# EAGLE design Placa de processamento (EAGLE 9.6.2)
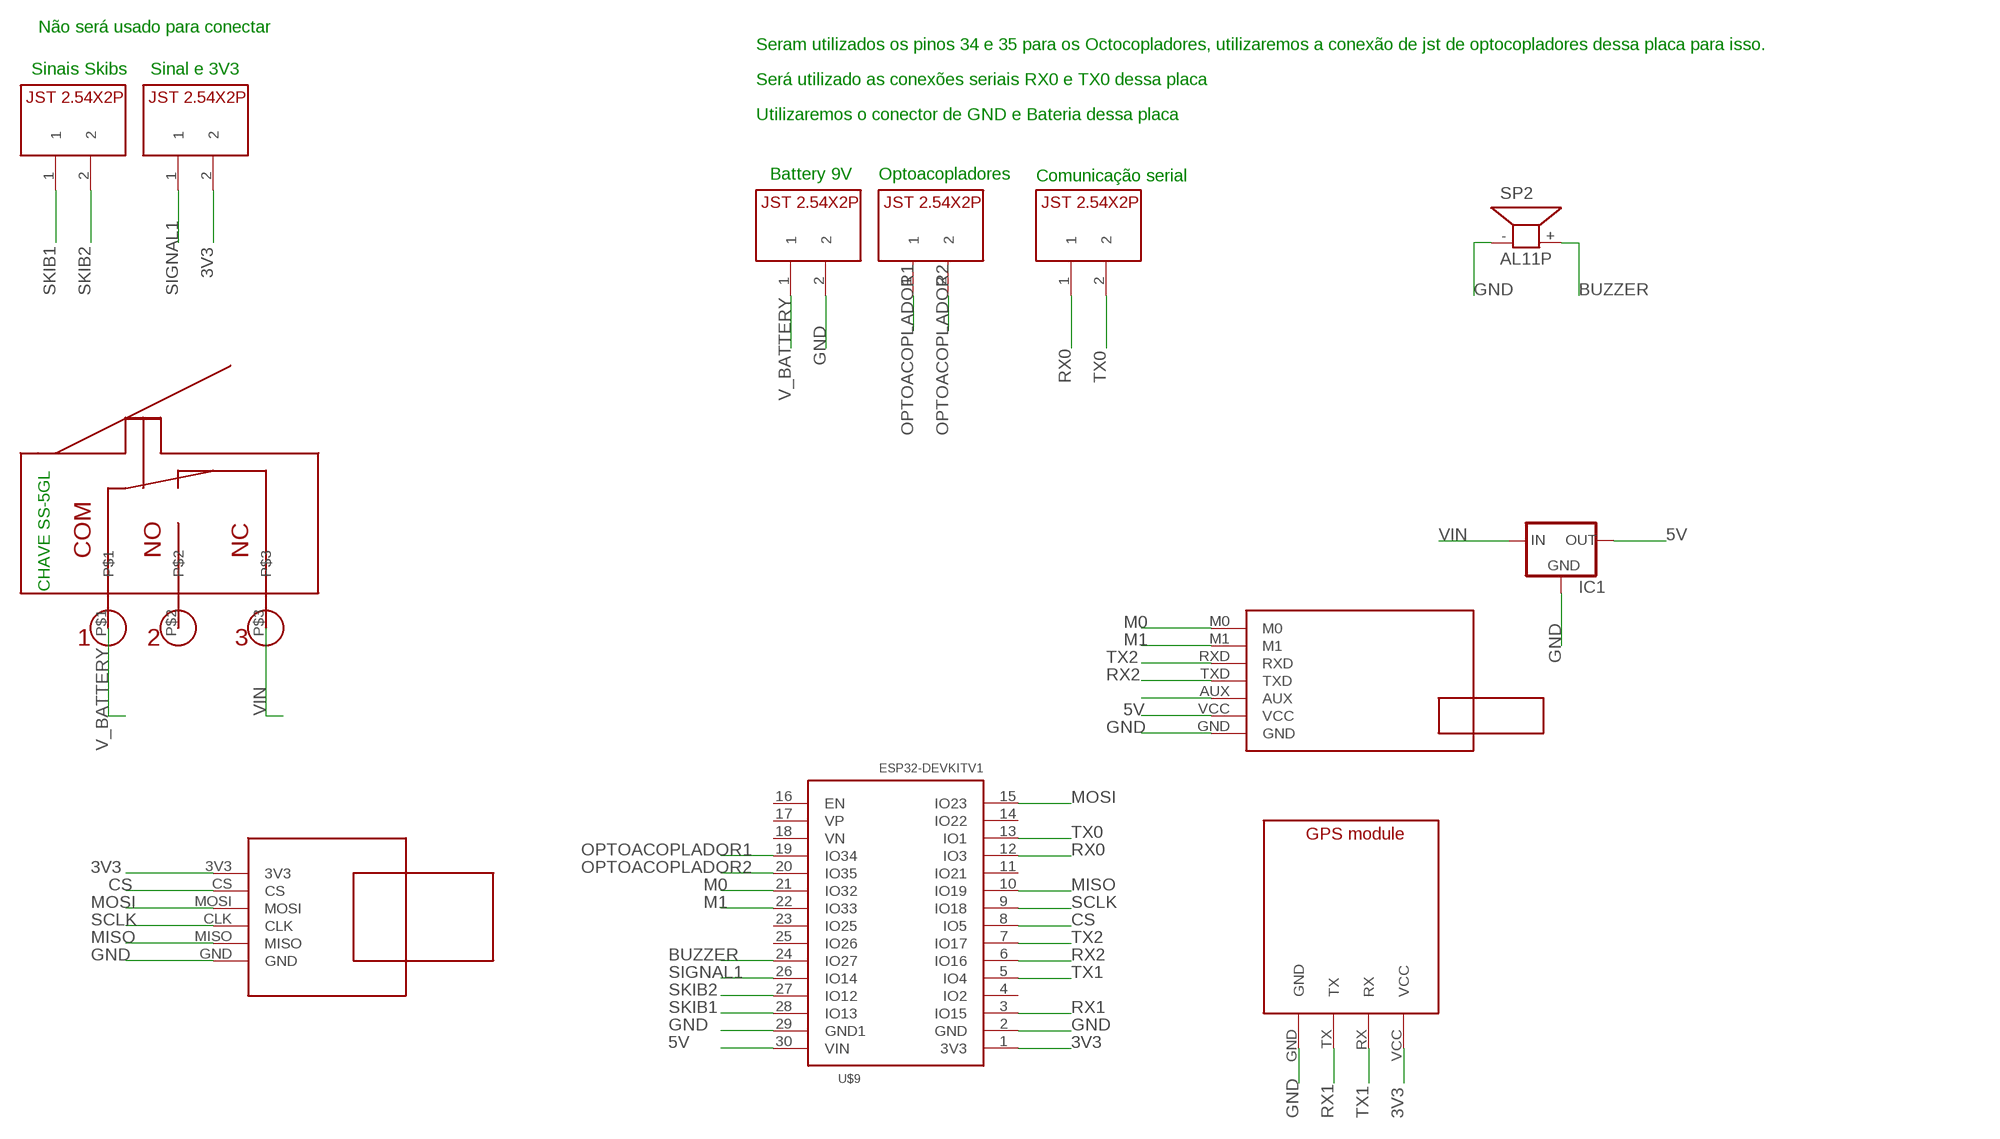
[diagram p0: schematic, sheet 1]

## Parts
IC1  78XXL  [78XXL]
SP2  AL11P  [AL11P]
U$2  MICROSD_SMALL_READER  [MICROSD_SMALL_READER_FOOTPRINT]
U$3  JST2.54X2P  [JST2.54X2P_FOOTPRINT]
U$4  JST2.54X2P  [JST2.54X2P_FOOTPRINT]
U$5  JST2.54X2P  [JST2.54X2P_FOOTPRINT]
U$6  JST2.54X2P  [JST2.54X2P_FOOTPRINT]
U$7  GPS_MODULE  [GPS_MODULE_FOOTPRINT]
U$8  E22-400T30D  [E22-400T30D_FOOTPRINT]
U$9  ESP32DEVKITV1  [ESP32-DEVKITV1]
U$10  JST2.54X2P  [JST2.54X2P_FOOTPRINT]
U$11  CHAVE_SS-5GL  [CHAVESS-5GL]

## Nets
3V3: U$2.3V3 U$5.2 U$7.VCC U$9.1(3V3)
5V: IC1.OUT U$8.VCC U$9.30(VIN)
BUZZER: SP2.+ U$9.24(IO27)
CS: U$2.CS U$9.8(IO5)
GND: IC1.GND SP2.- U$2.GND U$3.2 U$7.GND U$8.GND U$9.2(GND) U$9.29(GND1)
M0: U$8.M0 U$9.21(IO32)
M1: U$8.M1 U$9.22(IO33)
MISO: U$2.MISO U$9.10(IO19)
MOSI: U$2.MOSI U$9.15(IO23)
N$3: U$8.AUX
OPTOACOPLADOR1: U$6.1 U$9.19(IO34)
OPTOACOPLADOR2: U$6.2 U$9.20(IO35)
RX0: U$9.12(IO3) U$10.1
RX1: U$7.TX U$9.3(IO15)
RX2: U$8.TXD U$9.6(IO16)
SCLK: U$2.CLK U$9.9(IO18)
SIGNAL1: U$5.1 U$9.26(IO14)
SKIB1: U$4.1 U$9.28(IO13)
SKIB2: U$4.2 U$9.27(IO12)
TX0: U$9.13(IO1) U$10.2
TX1: U$7.RX U$9.5(IO4)
TX2: U$8.RXD U$9.7(IO17)
V_BATTERY: U$3.1 U$11.P$1
VIN: IC1.IN U$11.P$3
Unconnected: U$9.4(IO2) U$9.11(IO21) U$9.14(IO22) U$9.16(EN) U$9.17(VP) U$9.18(VN) U$9.23(IO25) U$9.25(IO26) U$11.P$2

## Notes on the sheet
- Não será usado para conectar
- Seram utilizados os pinos 34 e 35 para os Octocopladores, utilizaremos a conexão de jst de optocopladores dessa placa para isso.
- Sinais Skibs | Sinal e 3V3
- Será utilizado as conexões seriais RX0 e TX0 dessa placa
- Utilizaremos o conector de GND e Bateria dessa placa
- Battery 9V | Optoacopladores | Comunicação serial

## Library data of the parts
IC1 = v-reg:78XXL: VOLTAGE REGULATOR
SP2 = buzzer:AL11P: SPEAKER Source: Buerklin; OC_FARNELL: unknown; OC_NEWARK: unknown
U$2 = CRD:MICROSD_SMALL_READER
U$3-U$6 U$10 = CRD:JST2.54X2P: Conector JST 2 pinos (2.54mm de distância entre pinos)
U$7 = CRD:GPS_MODULE
U$8 = CRD:E22-400T30D
U$9 = ESP32-DEVKITV1:ESP32DEVKITV1
U$11 = CRD:CHAVE_SS-5GL

## Board
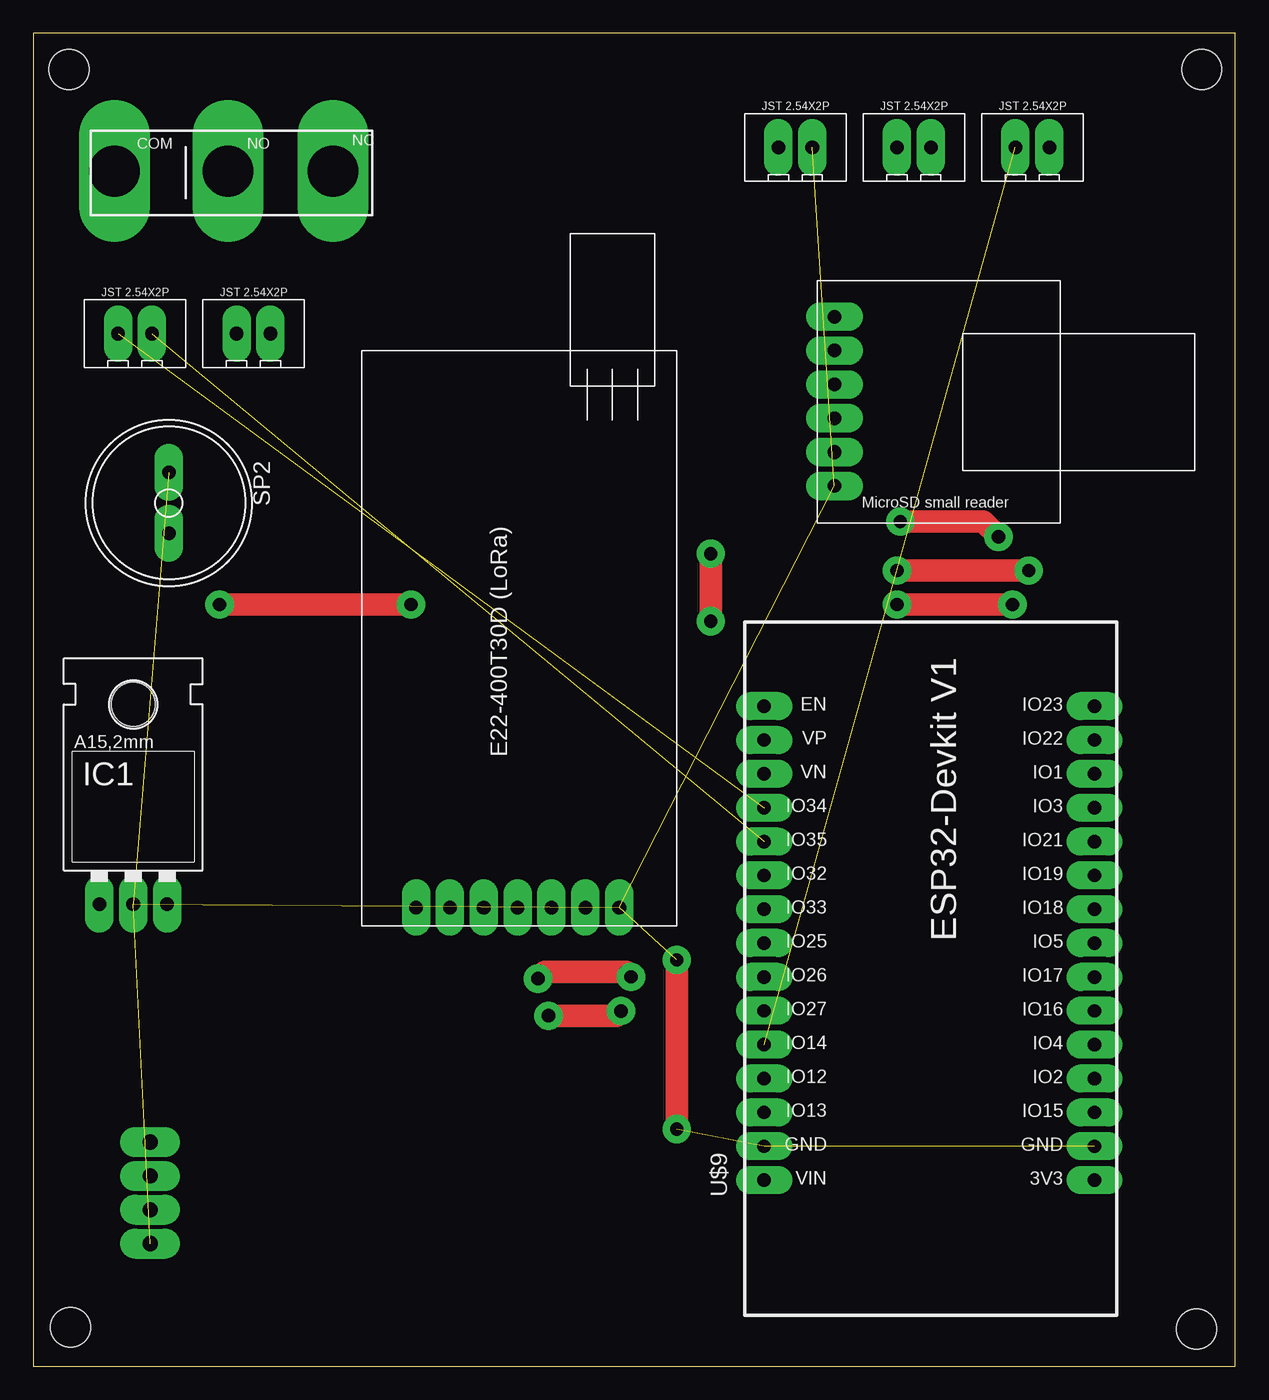
[diagram p1: board, top side]
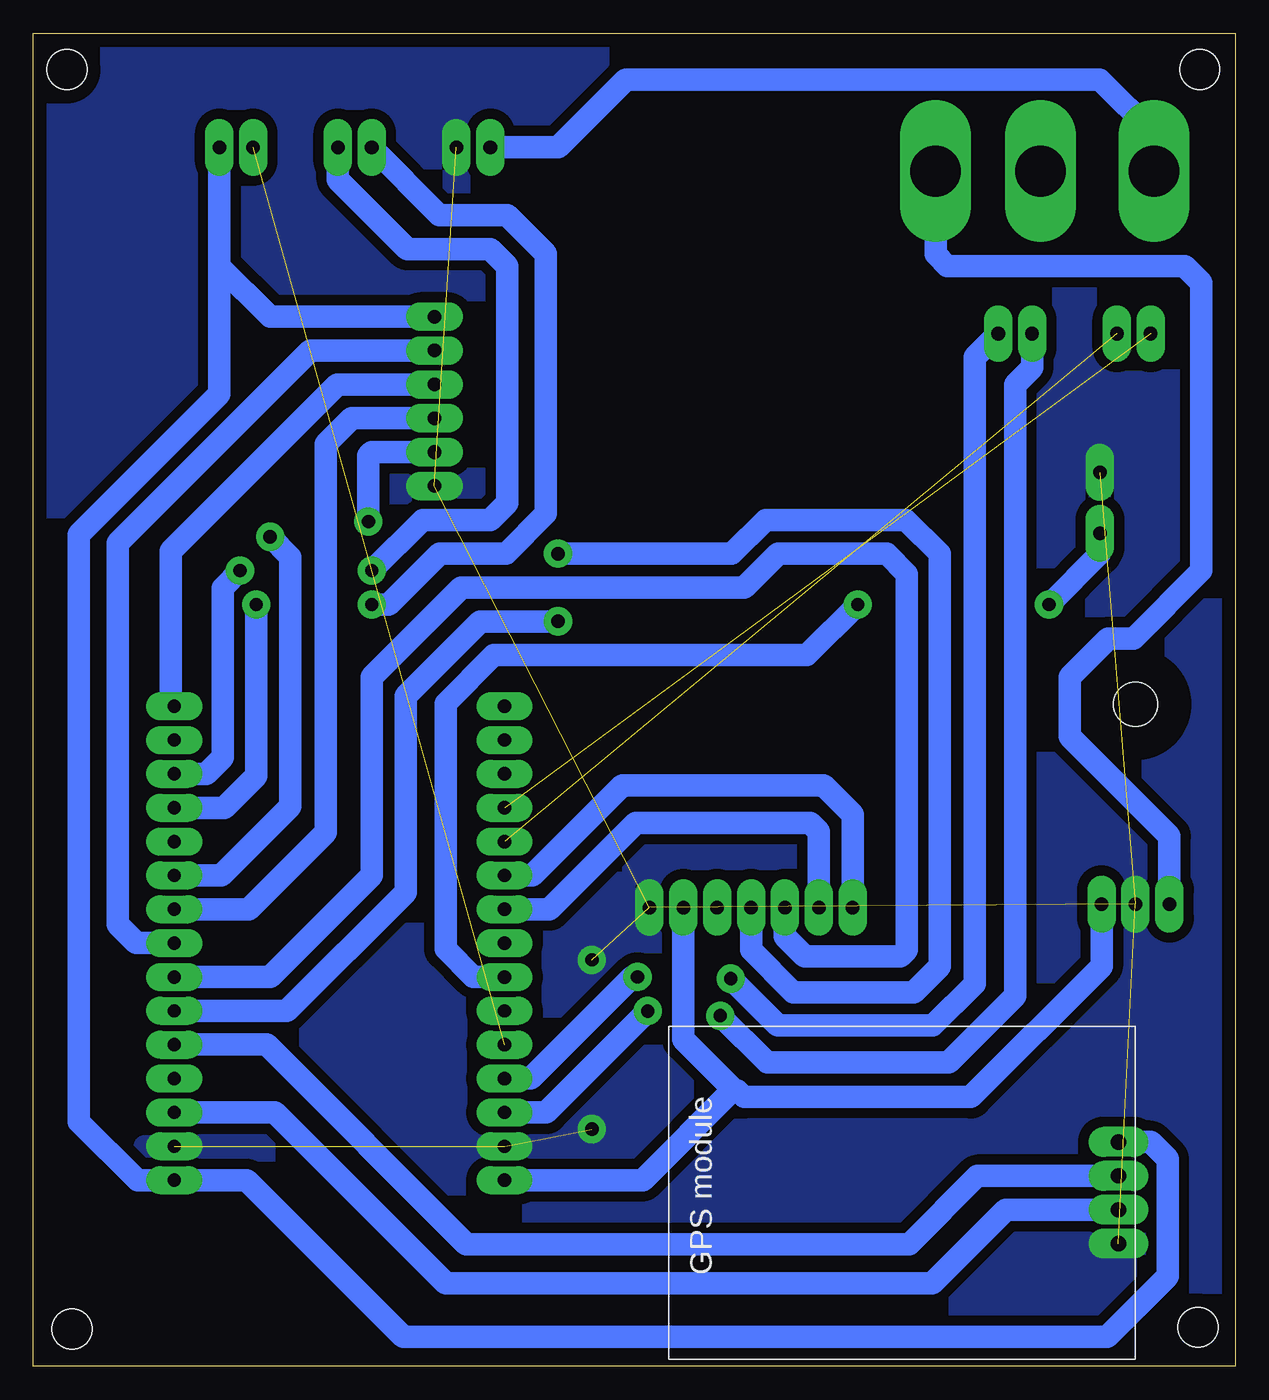
[diagram p2: board, bottom side, seen from below]

Size 90.15 x 100 mm. Coordinates in mm from the lower left corner, seen from the top.
Outline: 0,0 90.15,0 90.15,100 0,100 0,0
Copper layers (1*16): Top 0.035mm / dielectric 1.5mm / Bottom 0.035mm
Design rules "config": minimum track width 1.7mm, minimum drill 1mm, track to track 30mil, track to pad 20mil, pad to pad 6mil, via to via 6mil, smd to smd 6mil, copper to edge 40mil, drill to drill 6mil, minimum pad ring 22mil, minimum via ring 22mil, stop-mask expansion 4mil, vias tented up to drill 0mil, thermal gap 0mil
Holes 3 mm at 2.79,2.92 87.25,2.79 2.67,97.28 87.63,97.28

### Footprints (pad centres in the part's own frame; a part is rotated, then mirrored left to right if it is on the bottom)
78XXL = drill 1.016 long: GND 0,-3.81; IN -2.54,-3.81; OUT 2.54,-3.81 | hole 3.302: 0,11.176
AL11P = drill 1.016 pad 1.905 long: + 2.286,0; - -2.286,0
MICROSD_SMALL_READER_FOOTPRINT = drill 1.016 long: 3V3 -7.239,6.35; CLK -7.239,-1.27; CS -7.239,3.81; GND -7.239,-6.35; MISO -7.239,-3.81; MOSI -7.239,1.27
JST2.54X2P_FOOTPRINT = drill 1.016 pad 1.27 long: 1 -1.27,0; 2 1.27,0
GPS_MODULE_FOOTPRINT = drill 1.143 pad 1.778 long: GND -4.01,-16.51; RX 1.07,-16.51; TX -1.47,-16.51; VCC 3.61,-16.51
E22-400T30D_FOOTPRINT = drill 1.016 long: AUX -16.383,-0.762; GND -16.383,-5.842; M0 -16.383,9.398; M1 -16.383,6.858; RXD -16.383,4.318; TXD -16.383,1.778; VCC -16.383,-3.302
ESP32-DEVKITV1 = drill 1 pad 1.016 long: 1 -22.87,-13.54; 2 -20.33,-13.54; 3 -17.79,-13.54; 4 -15.25,-13.54; 5 -12.71,-13.54; 6 -10.17,-13.54; 7 -7.63,-13.54; 8 -5.09,-13.54; 9 -2.55,-13.54; 10 -0.01,-13.54; 11 2.53,-13.54; 12 5.07,-13.54; 13 7.61,-13.54; 14 10.15,-13.54; 15 12.69,-13.54; 16 12.69,11.23; 17 10.15,11.23; 18 7.61,11.23; 19 5.07,11.23; 20 2.53,11.23; 21 -0.01,11.23; 22 -2.55,11.23; 23 -5.09,11.23; 24 -7.63,11.23; 25 -10.17,11.23; 26 -12.71,11.23; 27 -15.25,11.23; 28 -17.79,11.23; 29 -20.33,11.23; 30 -22.87,11.23
CHAVESS-5GL = drill 3.8 pad 3.048 long: P$1 -9.144,0.762; P$2 -0.635,0.762; P$3 7.239,0.762

### Placement (x,y rotation side)
IC1  7.49,38.48 0 top
SP2  10.16,64.77 270 top
U$2  67.31,72.39 0 top
U$3  57.15,91.44 0 top
U$4  16.51,77.47 0 top
U$5  74.93,91.44 0 top
U$6  7.62,77.47 0 top
U$7  25.27,13.21 90 bottom
U$8  38.1,50.8 90 top
U$9  66.04,36.83 90 top
U$10  66.04,91.44 0 top
U$11  15.24,88.9 0 top

### Tracks (layer width: path | path; a pad name or v marks a point on that pad's centre or on a via)
3V3
  Bottom 1.7: U$7.VCC 6.35,16.82 5.08,15.55 5.08,6.73 9.62,2.19 62.39,2.19 74.16,13.95 U$9.1 82.28,13.96 82.32,13.94 86.73,18.35 86.73,62.4 76.2,72.93 76.2,82.55 | U$5.2 76.2,82.55 | 76.2,82.55 72.39,78.74 U$2.3V3
5V
  Bottom 1.7: 37.59,20.7 41.4,24.51 U$8.VCC | IC1.OUT 10.03,30 19.84,20.19 36.83,20.19 37.34,20.7 37.59,20.7 | 37.59,20.7 37.72,20.7 44.46,13.96 U$9.30
BUZZER  (via drill 1)
  Top 1.7: v28.32,57.15 v13.97,57.15
  Bottom 1.7: U$9.24 57.15,29.21 59.23,31.29 59.23,49.71 55.6,53.34 32.13,53.34 v28.32,57.15 | v13.97,57.15 10.16,60.96 SP2.+
CS
  Bottom 1.7: U$9.8 82.41,31.74 83.82,33.15 83.82,61.76 69.38,76.2 U$2.CS
GND  (via drill 1)  (8 unrouted)
  Top 1.7: v48.26,17.78 v48.26,30.48
  pour Bottom: -1.27,99.06 -1.27,0 90.17,0 90.17,99.06
M0
  Bottom 1.7: U$8.M0 28.7,41.4 30.86,43.56 45.97,43.56 52.72,36.82 U$9.21
M1
  Bottom 1.7: U$8.M1 31.24,40.13 31.88,40.77 44.96,40.77 51.45,34.28 U$9.22
MISO  (via drill 1 pad 1.3)
  Top 1.7: v72.39,62.23 71.25,63.37 v65.02,63.37
  Bottom 1.7: U$9.10 76.05,36.82 70.87,42 70.87,60.71 v72.39,62.23 | U$2.MISO 64.77,68.58 65.02,68.33 v65.02,63.37
MOSI
  Bottom 1.7: U$2.MOSI 60.09,73.64 67.34,73.64 79.83,61.15 79.83,49.77 U$9.15
OPTOACOPLADOR1  (1 unrouted)
OPTOACOPLADOR2  (1 unrouted)
RX0  (via drill 1)
  Top 1.7: v73.43,57.15 v64.77,57.15
  Bottom 1.7: 79.46,41.78 U$9.12 75.83,41.9 73.43,44.3 v73.43,57.15 | U$10.1 59.69,86.36 54.61,86.36 51.71,83.46 51.71,63.96 54.69,60.98 59.67,60.98 63.5,57.15 v64.77,57.15
RX1
  Bottom 1.7: U$9.3 72.04,19.04 59.23,6.23 22.73,6.23 17.22,11.74 U$7.TX
RX2  (via drill 1)
  Top 1.7: v50.8,55.88 v50.8,60.96
  Bottom 1.7: U$9.6 71.13,26.66 62.23,35.56 62.23,50.29 56.64,55.88 v50.8,55.88 | v50.8,60.96 37.77,60.96 35.23,63.5 24.71,63.5 22.17,60.96 22.17,29.98 24.12,28.04 33.15,28.04 36.32,31.21 U$8.TXD
SCLK
  Bottom 1.7: U$9.9 73.99,34.28 68.21,40.06 68.21,69.19 66.28,71.13 U$2.CLK
SIGNAL1  (1 unrouted)
SKIB1  (via drill 1)
  Top 1.7: v44.07,26.65 43.71,26.29 v38.63,26.29
  Bottom 1.7: U$9.28 51.68,19.04 v44.07,26.65 44.07,26.67 | v38.63,26.29 35.12,22.78 21.49,22.78 16.51,27.77 16.51,73.66 15.24,74.93 U$4.1
SKIB2  (via drill 1)
  Top 1.7: v44.83,29.21 44.45,29.59 38.35,29.59 v37.85,29.08
  Bottom 1.7: v44.83,29.21 45.21,29.21 52.84,21.58 U$9.27 | U$4.2 19.56,75.69 19.56,28.68 22.68,25.55 34.31,25.55 v37.85,29.08
TX0  (via drill 1)
  Top 1.7: v74.65,59.69 v64.77,59.69
  Bottom 1.7: U$9.13 77.18,44.44 75.95,45.67 75.95,58.4 v74.65,59.69 | U$10.2 67.31,89.03 62.1,83.82 55.88,83.82 54.61,82.55 54.61,64.77 55.88,63.5 60.96,63.5 v64.77,59.69
TX1
  Bottom 1.7: U$9.5 72.66,24.13 57.69,9.16 24.47,9.16 19.36,14.28 15.59,14.28 U$7.RX
TX2
  Bottom 1.7: U$9.7 72.4,29.2 64.77,36.83 64.77,51.69 58.04,58.42 36.83,58.42 34.29,60.96 26.16,60.96 24.64,59.44 24.64,31.24 25.15,30.73 32.28,30.73 33.78,32.23 U$8.RXD
V_BATTERY
  Bottom 1.7: U$11.P$1 6.1,92.46 10.16,96.52 45.72,96.52 50.8,91.44 U$3.1
VIN
  Bottom 1.7: U$11.P$3 22.48,83.44 21.59,82.55 20.32,82.55 | 20.32,82.55 3.81,82.55 2.54,81.28 2.54,59.68 7.62,54.6 | 7.62,54.6 9.54,54.6 12.43,51.7 12.43,47.26 4.95,39.77 IC1.IN | 7.62,54.61 7.62,54.6 | 20.32,82.55